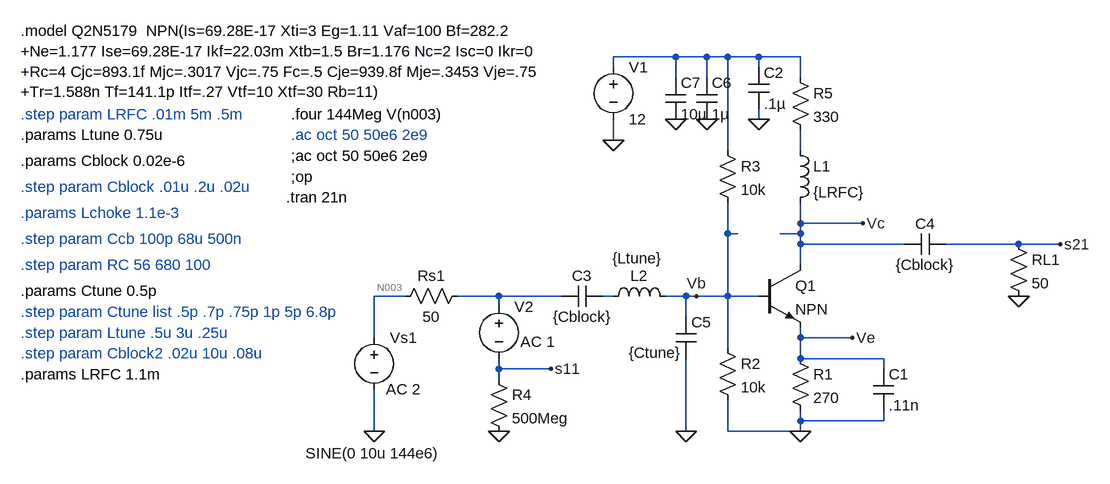
[diagram p0: schematic ECE_522_LNA_v4.asc]
ECE_522_LNA_v4.asc, the LTspice schematic file:
Version 4
SHEET 1 1516 724
WIRE 864 96 768 96
WIRE 912 96 864 96
WIRE 944 96 912 96
WIRE 992 96 944 96
WIRE 1056 96 992 96
WIRE 768 112 768 96
WIRE 992 112 992 96
WIRE 864 128 864 96
WIRE 912 128 912 96
WIRE 1056 128 1056 96
WIRE 992 192 992 176
WIRE 768 224 768 192
WIRE 944 240 944 96
WIRE 1056 240 1056 208
WIRE 1056 352 1056 320
WIRE 1152 352 1056 352
WIRE 944 368 944 320
WIRE 960 368 944 368
WIRE 1056 368 1056 352
WIRE 1056 368 1024 368
WIRE 1056 384 1056 368
WIRE 1216 384 1056 384
WIRE 1392 384 1280 384
WIRE 1456 384 1392 384
WIRE 1056 416 1056 384
WIRE 448 464 400 464
WIRE 592 464 528 464
WIRE 688 464 592 464
WIRE 768 464 752 464
WIRE 880 464 848 464
WIRE 896 464 880 464
WIRE 944 464 944 368
WIRE 944 464 896 464
WIRE 992 464 944 464
WIRE 592 480 592 464
WIRE 880 496 880 464
WIRE 400 528 400 464
WIRE 1056 528 1056 512
WIRE 1136 528 1056 528
WIRE 944 544 944 464
WIRE 1056 560 1056 528
WIRE 1184 560 1056 560
WIRE 592 576 592 560
WIRE 672 576 592 576
WIRE 1184 576 1184 560
WIRE 592 592 592 576
WIRE 1056 656 1056 640
WIRE 1184 656 1184 640
WIRE 1184 656 1056 656
WIRE 400 672 400 608
WIRE 880 672 880 560
WIRE 944 672 944 624
WIRE 1056 672 1056 656
WIRE 1056 672 944 672
FLAG 768 224 0
FLAG 1056 672 0
FLAG 992 192 0
FLAG 400 672 0
FLAG 1392 464 0
FLAG 592 672 0
FLAG 672 576 s11
FLAG 1456 384 s21
FLAG 1152 352 Vc
FLAG 1136 528 Ve
FLAG 896 464 Vb
FLAG 880 672 0
FLAG 864 192 0
FLAG 912 192 0
SYMBOL voltage 768 96 R0
WINDOW 123 0 0 Left 2
WINDOW 39 0 0 Left 2
SYMATTR InstName V1
SYMATTR Value 12
SYMBOL npn 992 416 R0
SYMATTR InstName Q1
SYMBOL res 1040 544 R0
SYMATTR InstName R1
SYMATTR Value 270
SYMBOL cap 976 112 R0
SYMATTR InstName C2
SYMATTR Value .1µ
SYMBOL res 928 528 R0
SYMATTR InstName R2
SYMATTR Value 10k
SYMBOL res 928 224 R0
SYMATTR InstName R3
SYMATTR Value 10k
SYMBOL cap 752 448 R90
WINDOW 0 0 32 VBottom 2
WINDOW 3 32 32 VTop 2
SYMATTR InstName C3
SYMATTR Value {Cblock}
SYMBOL cap 1280 368 R90
WINDOW 0 0 32 VBottom 2
WINDOW 3 32 32 VTop 2
SYMATTR InstName C4
SYMATTR Value {Cblock}
SYMBOL voltage 400 512 R0
WINDOW 3 -106 194 Left 2
WINDOW 123 18 95 Left 2
WINDOW 39 0 0 Left 2
SYMATTR Value SINE(0 10u 144e6)
SYMATTR Value2 AC 2
SYMATTR InstName Vs1
SYMBOL res 1376 368 R0
SYMATTR InstName RL1
SYMATTR Value 50
SYMBOL res 544 448 R90
WINDOW 0 0 56 VBottom 2
WINDOW 3 32 56 VTop 2
SYMATTR InstName Rs1
SYMATTR Value 50
SYMBOL voltage 592 464 R0
WINDOW 123 33 70 Left 2
WINDOW 39 0 0 Left 2
SYMATTR Value2 AC 1
SYMATTR InstName V2
SYMATTR Value ""
SYMBOL res 576 576 R0
SYMATTR InstName R4
SYMATTR Value 500Meg
SYMBOL res 1040 112 R0
SYMATTR InstName R5
SYMATTR Value 330
SYMBOL ind 1040 224 R0
SYMATTR InstName L1
SYMATTR Value {LRFC}
SYMBOL cap 864 496 R0
WINDOW 3 -72 55 Left 2
SYMATTR InstName C5
SYMATTR Value {Ctune}
SYMBOL ind 752 480 R270
WINDOW 0 32 56 VTop 2
WINDOW 3 90 53 VBottom 2
SYMATTR InstName L2
SYMATTR Value {Ltune}
SYMBOL cap 1168 576 R0
SYMATTR InstName C1
SYMATTR Value .11n
SYMBOL cap 896 128 R0
SYMATTR InstName C6
SYMATTR Value 1µ
SYMBOL cap 848 128 R0
SYMATTR InstName C7
SYMATTR Value 10µ
TEXT -144 56 Left 2 !.model Q2N5179  NPN(Is=69.28E-17 Xti=3 Eg=1.11 Vaf=100 Bf=282.2 \n+Ne=1.177 Ise=69.28E-17 Ikf=22.03m Xtb=1.5 Br=1.176 Nc=2 Isc=0 Ikr=0 \n+Rc=4 Cjc=893.1f Mjc=.3017 Vjc=.75 Fc=.5 Cje=939.8f Mje=.3453 Vje=.75 \n+Tr=1.588n Tf=141.1p Itf=.27 Vtf=10 Xtf=30 Rb=11)
TEXT 272 248 Left 2 !;ac oct 50 50e6 2e9
TEXT -144 256 Left 2 !.params Cblock 0.02e-6
TEXT 272 184 Left 2 !.four 144Meg V(n003)
TEXT -144 184 Left 2 ;.step param LRFC .01m 5m .5m
TEXT -144 584 Left 2 !.params LRFC 1.1m
TEXT -144 416 Left 2 ;.step param RC 56 680 100
TEXT 272 280 Left 2 !;op
TEXT -144 376 Left 2 ;.step param Ccb 100p 68u 500n
TEXT -144 336 Left 2 ;.params Lchoke 1.1e-3
TEXT -144 296 Left 2 ;.step param Cblock .01u .2u .02u
TEXT -144 520 Left 2 ;.step param Ltune .5u 3u .25u
TEXT -144 216 Left 2 !.params Ltune 0.75u
TEXT -144 552 Left 2 ;.step param Cblock2 .02u 10u .08u
TEXT -144 488 Left 2 ;.step param Ctune list .5p .7p .75p 1p 5p 6.8p
TEXT -144 456 Left 2 !.params Ctune 0.5p
TEXT 272 216 Left 2 ;.ac oct 50 50e6 2e9
TEXT 264 312 Left 2 !.tran 21n

The netlist it stands for:
* ECE_522_LNA_v4.asc
V1 N001 0 12
Q1 Vc Vb Ve 0 NPN
R1 Ve 0 270
C2 N001 0 .1µ
R2 Vb 0 10k
R3 N001 Vb 10k
C3 N005 N004 {Cblock}
C4 s21 Vc {Cblock}
Vs1 N003 0 SINE(0 10u 144e6) AC 2
RL1 s21 0 50
Rs1 N004 N003 50
V2 N004 s11 AC 1
R4 s11 0 500Meg
R5 N001 N002 330
L1 N002 Vc {LRFC}
C5 Vb 0 {Ctune}
L2 N005 Vb {Ltune}
C1 Ve 0 .11n
C6 N001 0 1µ
C7 N001 0 10µ
.model NPN NPN
.model PNP PNP
.lib standard.bjt
.model Q2N5179  NPN(Is=69.28E-17 Xti=3 Eg=1.11 Vaf=100 Bf=282.2
+Ne=1.177 Ise=69.28E-17 Ikf=22.03m Xtb=1.5 Br=1.176 Nc=2 Isc=0 Ikr=0
+Rc=4 Cjc=893.1f Mjc=.3017 Vjc=.75 Fc=.5 Cje=939.8f Mje=.3453 Vje=.75
+Tr=1.588n Tf=141.1p Itf=.27 Vtf=10 Xtf=30 Rb=11)
;ac oct 50 50e6 2e9
.params Cblock 0.02e-6
.four 144Meg V(n003)
* .step param LRFC .01m 5m .5m
.params LRFC 1.1m
* .step param RC 56 680 100
;op
* .step param Ccb 100p 68u 500n
* .params Lchoke 1.1e-3
* .step param Cblock .01u .2u .02u
* .step param Ltune .5u 3u .25u
.params Ltune 0.75u
* .step param Cblock2 .02u 10u .08u
* .step param Ctune list .5p .7p .75p 1p 5p 6.8p
.params Ctune 0.5p
* .ac oct 50 50e6 2e9
.tran 21n
.backanno
.end